# EAGLE board ACB-R1.0-43-CH13 (EAGLE 6.6.0), part 1 of 2
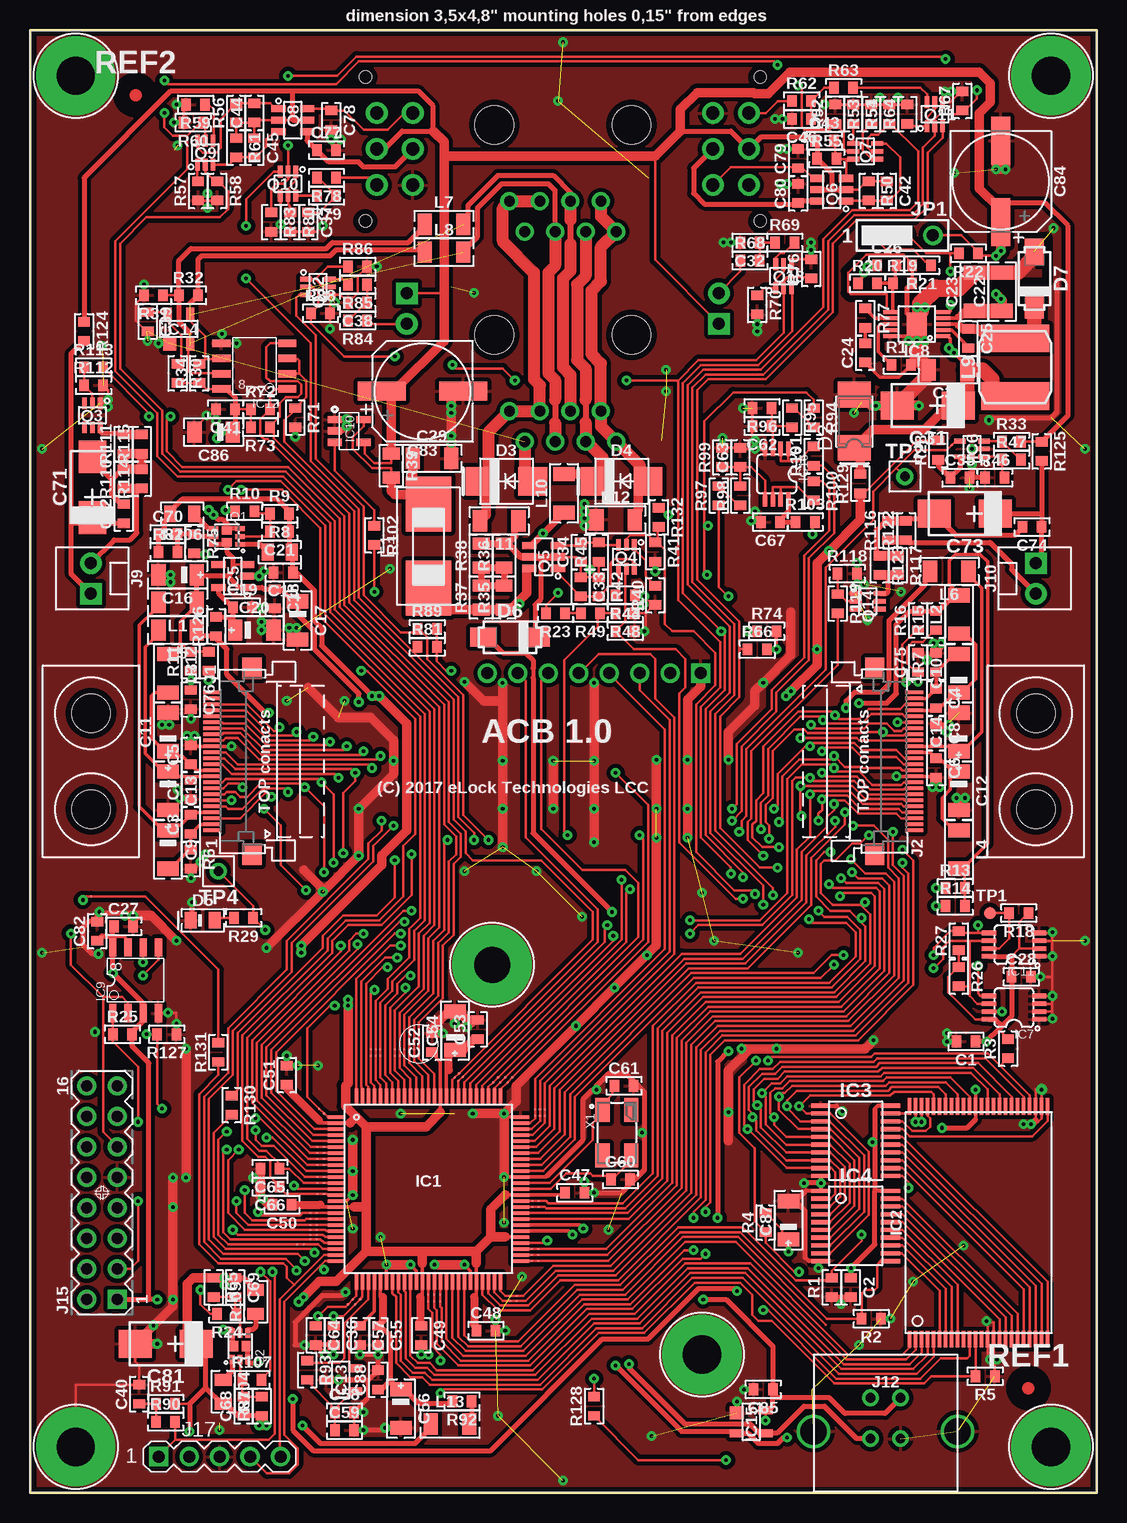
[diagram p5: board, top side]
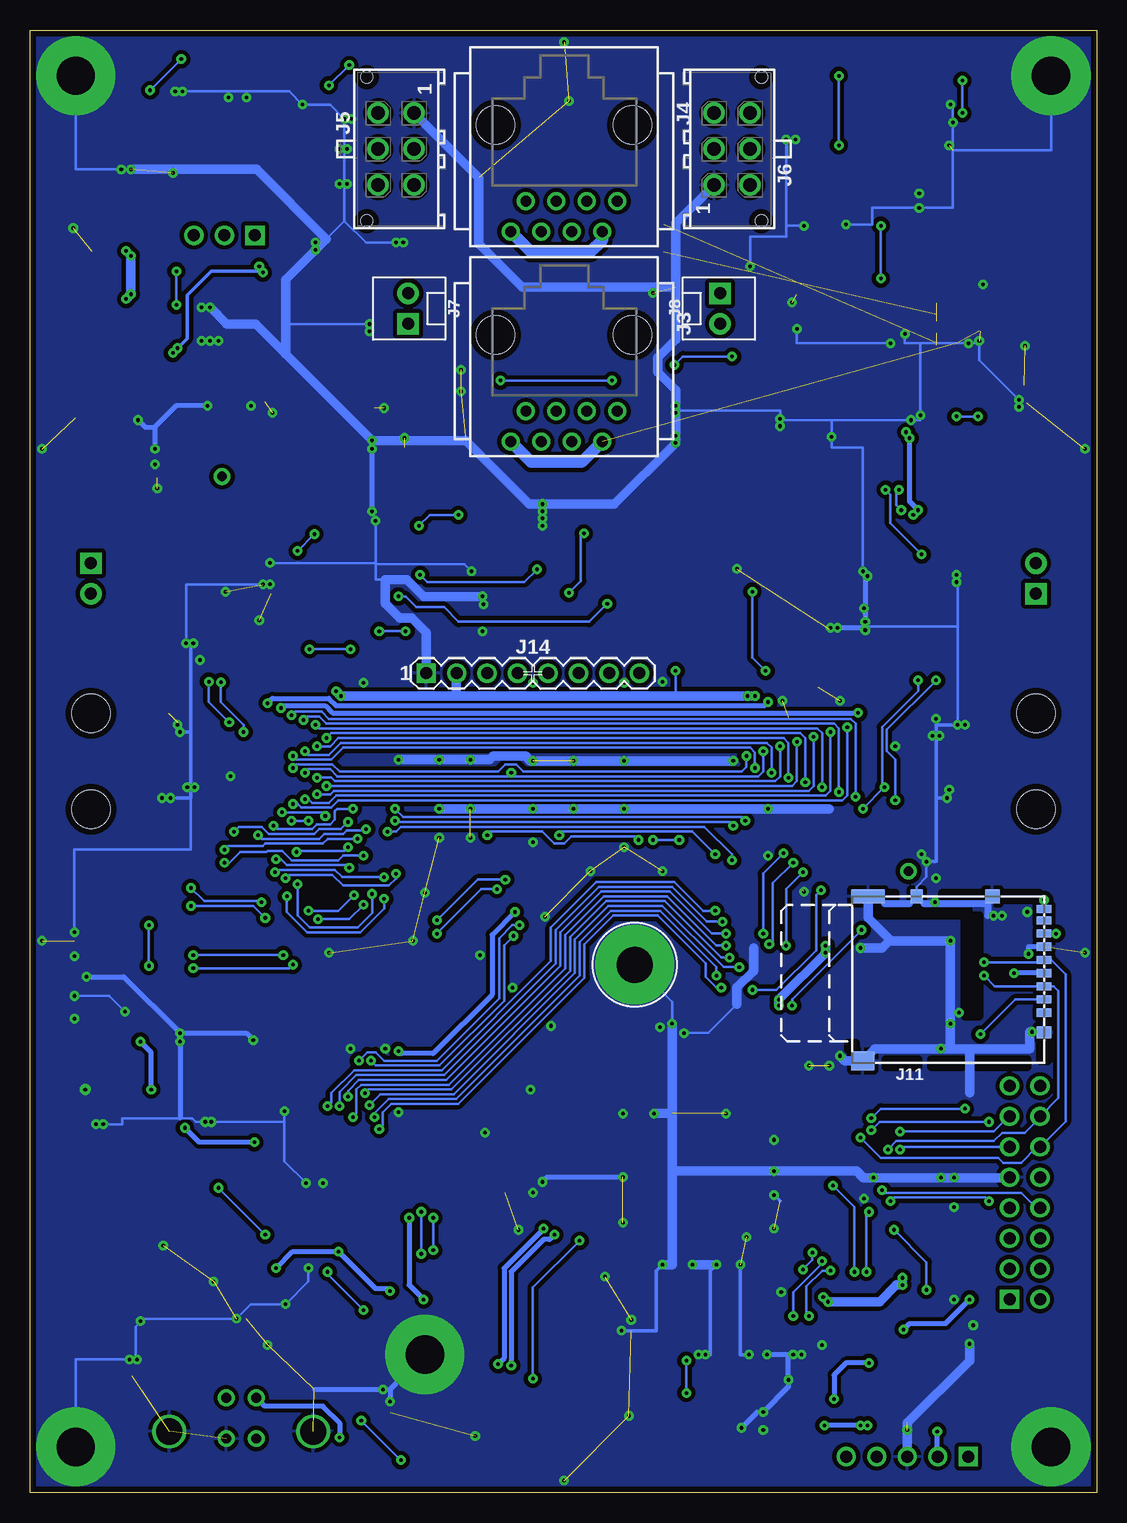
[diagram p6: board, bottom side, seen from below]

Size 88.9 x 121.92 mm. Coordinates in mm from the lower left corner, seen from the top.
Copper layers (1*16): Top 0.035mm / dielectric 1.5mm / Bottom 0.035mm
Design rules "default *": minimum track width 0.2mm, minimum drill 0.3mm, track to track 0.2mm, track to pad 0.2mm, pad to pad 0.2mm, via to via 0.2mm, smd to smd 0.001mm, copper to edge 0.5mm, drill to drill 0.2mm, minimum pad ring 0.3mm, minimum via ring 0.25mm, stop-mask expansion 0.1mm, vias tented up to drill 0.6mm, thermal gap 0.35mm
Net classes: 1 HV: clearance 0.3 mm to class 0
tRestrict: 34 lines

## Footprints (pad centres in the part's own frame; a part is rotated, then mirrored left to right if it is on the bottom)
0603 = smd 0.79 x 0.99: 1 -0.8,0; 2 0.8,0
1206-POL-C = smd 1.19 x 1.79: + -1.6,0; - 1.6,0
1206 = smd 1.19 x 1.79: 1 -1.6,0; 2 1.6,0
CT-C = smd 2.743 x 2.311: + -2.54,0; - 2.54,0
CAP_8MM_DIA_SMT = smd 1.59 x 3.99: 1 0,3.4; 2 0,-3.4
SMA = smd 2.159 x 2.743: + -2.311,0.003; - 2.108,-0.002
SMB = smd 2.4 x 2.4: A 2.2,0; C -2.2,0
0805-POL-D = smd 0.99 x 1.39: A 1,0; K -1,0
SMA' = smd 2.21 x 1.575: A -2.223,0; K 2.223,0
LITTLEFUSE0154 = smd 4.6 x 3.8: 1 3.5,0; 2 -3.5,0
CAM-HOLDER = hole 3.2: 0,4; 0,-4
TQFP100_14X14_0,5MM = smd 1.39 x 0.28: 1 -7.7,6; 2 -7.7,5.5; 3 -7.7,5; 4 -7.7,4.5; 5 -7.7,4; 6 -7.7,3.5; 7 -7.7,3; 8 -7.7,2.5; 9 -7.7,2; 10 -7.7,1.5; 11 -7.7,1; 12 -7.7,0.5; 13 -7.7,0; 14 -7.7,-0.5; 15 -7.7,-1; 16 -7.7,-1.5; 17 -7.7,-2; 18 -7.7,-2.5; 19 -7.7,-3; 20 -7.7,-3.5; 21 -7.7,-4; 22 -7.7,-4.5; 23 -7.7,-5; 24 -7.7,-5.5; 25 -7.7,-6; 51 7.7,-6; 52 7.7,-5.5; 53 7.7,-5; 54 7.7,-4.5; 55 7.7,-4; 56 7.7,-3.5; 57 7.7,-3; 58 7.7,-2.5; 59 7.7,-2; 60 7.7,-1.5; 61 7.7,-1; 62 7.7,-0.5; 63 7.7,0; 64 7.7,0.5; 65 7.7,1; 66 7.7,1.5; 67 7.7,2; 68 7.7,2.5; 69 7.7,3; 70 7.7,3.5; 71 7.7,4; 72 7.7,4.5; 73 7.7,5; 74 7.7,5.5; 75 7.7,6 | smd 0.28 x 1.39: 26 -6,-7.7; 27 -5.5,-7.7; 28 -5,-7.7; 29 -4.5,-7.7; 30 -4,-7.7; 31 -3.5,-7.7; 32 -3,-7.7; 33 -2.5,-7.7; 34 -2,-7.7; 35 -1.5,-7.7; 36 -1,-7.7; 37 -0.5,-7.7; 38 0,-7.7; 39 0.5,-7.7; 40 1,-7.7; 41 1.5,-7.7; 42 2,-7.7; 43 2.5,-7.7; 44 3,-7.7; 45 3.5,-7.7; 46 4,-7.7; 47 4.5,-7.7; 48 5,-7.7; 49 5.5,-7.7; 50 6,-7.7; 76 6,7.7; 77 5.5,7.7; 78 5,7.7; 79 4.5,7.7; 80 4,7.7; 81 3.5,7.7; 82 3,7.7; 83 2.5,7.7; 84 2,7.7; 85 1.5,7.7; 86 1,7.7; 87 0.5,7.7; 88 0,7.7; 89 -0.5,7.7; 90 -1,7.7; 91 -1.5,7.7; 92 -2,7.7; 93 -2.5,7.7; 94 -3,7.7; 95 -3.5,7.7; 96 -4,7.7; 97 -4.5,7.7; 98 -5,7.7; 99 -5.5,7.7; 100 -6,7.7
48-TSOP-I = smd 1.4 x 0.28: 1 -9.7,5.75; 2 -9.7,5.25; 3 -9.7,4.75; 4 -9.7,4.25; 5 -9.7,3.75; 6 -9.7,3.25; 7 -9.7,2.75; 8 -9.7,2.25; 9 -9.7,1.75; 10 -9.7,1.25; 11 -9.7,0.75; 12 -9.7,0.25; 13 -9.7,-0.25; 14 -9.7,-0.75; 15 -9.7,-1.25; 16 -9.7,-1.75; 17 -9.7,-2.25; 18 -9.7,-2.75; 19 -9.7,-3.25; 20 -9.7,-3.75; 21 -9.7,-4.25; 22 -9.7,-4.75; 23 -9.7,-5.25; 24 -9.7,-5.75; 25 9.7,-5.75; 26 9.7,-5.25; 27 9.7,-4.75; 28 9.7,-4.25; 29 9.7,-3.75; 30 9.7,-3.25; 31 9.7,-2.75; 32 9.7,-2.25; 33 9.7,-1.75; 34 9.7,-1.25; 35 9.7,-0.75; 36 9.7,-0.25; 37 9.7,0.25; 38 9.7,0.75; 39 9.7,1.25; 40 9.7,1.75; 41 9.7,2.25; 42 9.7,2.75; 43 9.7,3.25; 44 9.7,3.75; 45 9.7,4.25; 46 9.7,4.75; 47 9.7,5.25; 48 9.7,5.75
TSSOP20 = smd 1.6 x 0.35: 1 -2.9,2.925; 2 -2.9,2.275; 3 -2.9,1.625; 4 -2.9,0.975; 5 -2.9,0.325; 6 -2.9,-0.325; 7 -2.9,-0.975; 8 -2.9,-1.625; 9 -2.9,-2.275; 10 -2.9,-2.925; 11 2.9,-2.925; 12 2.9,-2.275; 13 2.9,-1.625; 14 2.9,-0.975; 15 2.9,-0.325; 16 2.9,0.325; 17 2.9,0.975; 18 2.9,1.625; 19 2.9,2.275; 20 2.9,2.925
SOT23-5 = smd 0.59 x 1.19: 1 -0.95,-1.2; 2 0,-1.2; 3 0.95,-1.2; 4 0.95,1.2; 5 -0.95,1.2
SC-70-5 = smd 0.39 x 0.99: 1 -0.65,-1; 2 0,-1; 3 0.65,-1; 4 0.65,1; 5 -0.65,1
MSOP-08 = smd 0.38 x 1.2: 1 -1,-2.1; 2 -0.35,-2.1; 3 0.3,-2.1; 4 0.95,-2.1; 5 0.95,2.1; 6 0.3,2.1; 7 -0.35,2.1; 8 -1,2.1
MSOP10EXP = smd 0.3 x 1.2: 1 -1,-2.2; 2 -0.5,-2.2; 3 0,-2.2; 4 0.5,-2.2; 5 1,-2.2; 6 1,2.2; 7 0.5,2.2; 8 0,2.2; 9 -0.5,2.2; 10 -1,2.2 | smd 1.88 x 1.68: EP 0,0
SO-08 = smd 0.61 x 1.524: 1 -1.905,-2.743; 2 -0.635,-2.743; 3 0.635,-2.743; 4 1.905,-2.743; 5 1.905,2.743; 6 0.635,2.743; 7 -0.635,2.743; 8 -1.905,2.743
SOT23-5' = smd 0.6 x 1.2: 1 -0.95,-1.206; 2 0,-1.206; 3 0.95,-1.206; 4 0.95,1.206; 5 -0.95,1.206
SO08 = smd 0.61 x 1.524: 1 -1.905,-2.743; 2 -0.635,-2.743; 3 0.635,-2.743; 4 1.905,-2.743; 5 1.905,2.743; 6 0.635,2.743; 7 -0.635,2.743; 8 -1.905,2.743
SOT23 = smd 0.69 x 1.19: 1 0.95,1.2; 2 -0.95,1.2; 3 0,-1.2
SOT-143 = smd 1.09 x 1.19: 1 -0.75,-1.2 | smd 0.69 x 1.19: 2 0.95,-1.2; 3 0.95,1.2; 4 -0.95,1.2
FH12A-24S-05SH = smd 0.3 x 1.5: 1 -5.75,2.8; 2 -5.25,2.8; 3 -4.75,2.8; 4 -4.25,2.8; 5 -3.75,2.8; 6 -3.25,2.8; 7 -2.75,2.8; 8 -2.25,2.8; 9 -1.75,2.8; 10 -1.25,2.8; 11 -0.75,2.8; 12 -0.25,2.8; 13 0.25,2.8; 14 0.75,2.8; 15 1.25,2.8; 16 1.75,2.8; 17 2.25,2.8; 18 2.75,2.8; 19 3.25,2.8; 20 3.75,2.8; 21 4.25,2.8; 22 4.75,2.8; 23 5.25,2.8; 24 5.75,2.8 | smd 1.8 x 1.6: C1 -7.75,-0.5; C2 7.75,-0.5
RJ8-8-180 = drill 0.9 pad 1.4: 1 -4.445,6.35; 2 -3.175,8.89; 3 -1.905,6.35; 4 -0.635,8.89; 5 0.635,6.35; 6 1.905,8.89; 7 3.175,6.35; 8 4.445,8.89 | hole 3.2: 5.715,0; -5.715,0
MOLEX430450613 = drill 1.1 pad 1.8: 1 3,-1.5; 2 0,-1.5; 3 -3,-1.5; 4 3,1.5; 5 0,1.5; 6 -3,1.5 | hole 1: 6,2.45; -6,2.45
3-641215-2 = drill 1 pad 1.8 square: 1 1.27,0 | drill 1 pad 1.8: 2 -1.27,0
DM3AT = smd 0.69 x 1.19: 1 3.3,8; 2 2.2,8; 3 1.1,8; 4 0,8; 5 -1.1,8; 6 -2.2,8; 7 -3.3,8; 8 -4.4,8; G2 -5.35,8 | smd 0.99 x 1.19: G1 4.95,8 | smd 1.19 x 1.19: G3 -6.4,3.7 | smd 1.19 x 0.99: G4 -6.4,-2.6 | smd 1.19 x 2.79: G5 -6.4,-6.65 | smd 1.59 x 1.89: G6 7.3,-7.1
USB_B_180 = drill 0.8 pad 1.4: 1_+5V 1.25,2.8; 2_D- -1.25,2.8; 3_D+ -1.25,-0.6; 4_GND 1.25,-0.6 | drill 2.2 pad 2.8: SH1 -6,0; SH2 6,0
MA08-1-MALE = drill 1 pad 1.6 square: 1 -8.89,0 | drill 1 pad 1.6: 2 -6.35,0; 3 -3.81,0; 4 -1.27,0; 5 1.27,0; 6 3.81,0; 7 6.35,0; 8 8.89,0
MA08-2 = drill 1 pad 1.6 square: 1 -8.89,-1.27 | drill 1 pad 1.6: 2 -8.89,1.27; 3 -6.35,-1.27; 4 -6.35,1.27; 5 -3.81,-1.27; 6 -3.81,1.27; 7 -1.27,-1.27; 8 -1.27,1.27; 9 1.27,-1.27; 10 1.27,1.27; 11 3.81,-1.27; 12 3.81,1.27; 13 6.35,-1.27; 14 6.35,1.27; 15 8.89,-1.27; 16 8.89,1.27
MA05-1 = drill 1 pad 1.6 square: 1 -5.08,0 | drill 1 pad 1.6: 2 -2.54,0; 3 0,0; 4 2.54,0; 5 5.08,0
JP3CLOSE12 = drill 1 pad 1.626 square: 1 -2.54,0 | drill 1 pad 1.626: 2 0,0; 3 2.54,0
NR6028 = smd 2.3 x 5.7: 1 2.4,0; 2 -2.4,0
TEMP-PAD = smd 0.2 x 0.2: P$1 0,0
PCB-ACB = drill 3.2 pad 6.6: PAD_GND_1 3.81,118.11; PAD_GND_2 85.09,118.11; PAD_GND_3 3.81,3.81; PAD_GND_4 85.09,3.81
PCB-VPS = drill 3.2 pad 6.6: VPS_PCB_1 55,4
BT_MODULE_BRD = drill 3 pad 6.6: 1 25.5,20.5
MICRO_FET = smd 0.4 x 0.8: 1 -0.65,-1.1; 2 0,-1.1; 3 0.65,-1.1; 4 0.65,1.1; 5 0,1.1; 6 -0.65,1.1 | smd 0.7 x 0.86: P1 -0.5,0; P2 0.5,0
SC70-6 = smd 0.39 x 0.99: 1 -0.65,-1; 2 0,-1; 3 0.65,-1; 4 0.65,1; 5 0,1; 6 -0.65,1
SSOT-6 = smd 0.6 x 1.2: 1 -0.95,-1.2; 2 0,-1.2; 3 0.95,-1.206; 4 0.95,1.2; 5 0,1.2; 6 -0.95,1.2
0805 = smd 0.99 x 1.39: 1 -1,0; 2 1,0
SMD_ROUND_1MM = smd 1 x 1: P$1 0,0
TH_ROUND_14MM08MM = drill 0.8 pad 1.4: P$1 0,0
7B = smd 2 x 1.2: 1 -1.9,-1.2; 2 1.9,-1.2; 3 1.9,1.2; 4 -1.9,1.2

## Placement (x,y rotation side)
C1  100n  [0603]  78,37.6 180 top
C2  100n  [0603]  68.4,17.1 270 top
C3  100n  [0603]  13.4,55.7 90 top
C4  100n  [0603]  75.5,66.2 270 top
C5  100n  [0603]  13.4,61.5 90 top
C6  100n  [0603]  75.5,60.4 270 top
C7  100n  [0603]  13.4,58.6 90 top
C8  100n  [0603]  75.5,63.3 270 top
C9  10uTA  [1206-POL-C]  11.5,53.6 270 top
C10  10uTA  [1206-POL-C]  77.4,68.3 90 top
C11  10uTA  [1206-POL-C]  11.5,63.4 90 top
C12  10uTA  [1206-POL-C]  77.4,58.5 270 top
C13  10uTA  [1206-POL-C]  11.5,58.5 270 top
C14  10uTA  [1206-POL-C]  77.4,63.4 90 top
C15  10u  [0603]  21.1,76.7 180 top
C16  10uTA  [1206-POL-C]  12.3,76.5 180 top
C17  10uTA  [1206-POL-C]  22.3,72.7 270 top
C18  100n  [0603]  20.4,74.5 270 top
C19  100n  [0603]  17.7,73.8 0 top
C20  10uTA  [1206-POL-C]  18.7,71.9 0 top
C21  1n->10n  [0603]  20.8,80.1 180 top
C22  4u7/50  [1206]  81,100.1 90 top
C23  4u7/50  [1206]  78.7,100.1 90 top
C24  1n  [0603]  69.6,95 90 top
C25  470n/25  [0603]  78.2,96.2 270 top
C26  10p  [0603]  71.4,102.3 0 top
C27  100n  [0603]  7.8,47.2 0 top
C28  100n  [0603]  82.6,43 0 top
C29  4u7/50  [1206]  33.5,86.2 0 top
C30  47u/6.3  [1206]  76.5,93.6 180 top
C31  47uTC  [CT-C]  74.8,90.6 180 top
C32  100n  [0603]  60,104.2 180 top
C33  100n  [0603]  45.9,75.5 270 top
C34  1n  [0603]  45.9,78.4 90 top
C35  100n  [0603]  77.5,84.6 0 top
C36  100n  [0603]  25.3,13.1 270 top
C37  100n  [0603]  23.2,105.9 270 top
C38  100n  [0603]  27.3,99.2 180 top
C39  100n  [0603]  9.8,97.6 270 top
C40  100n  [0603]  9.1,8.2 90 top
C41  100n  [0603]  16.3,90.3 180 top
C42  100n  [0603]  71.4,108.5 270 top
C43  1n  [0603]  66.2,112.7 0 top
C44  1n  [0603]  18.7,115 90 top
C45  100n  [0603]  18.7,112.1 270 top
C46  100n  [0603]  64.3,114.5 180 top
C47  100n  [0603]  45.4,25 0 top
C48  1u  [0603]  38,13.5 0 top
C49  100n  [0603]  32.6,13.1 270 top
C50  1u  [0603]  21,24 180 top
C51  100n  [0603]  21.4,34.8 90 top
C52  1u  [0603]  33.5,37.5 90 top
C53  10u  [0603]  37.3,38.6 90 top
C54  10uTA  [1206-POL-C]  35.4,38.5 90 top
C55  100n  [0603]  29,13.1 270 top
C56  10uTA  [1206-POL-C]  30.9,7 270 top
C57  100n->10n  [0603]  27.5,13.1 270 top
C58  100n  [0603]  26.2,6.7 0 top
C59  1u->100n  [0603]  26.2,5.2 0 top
C60  18p  [0603]  49.2,26.1 0 top
C61  18p  [0603]  49.5,33.9 0 top
C62  1n  [0603]  61,88.9 180 top
C63  1n  [0603]  59.2,86.3 90 top
C64  100n  [0603]  23.8,13.1 270 top
C65  1n  [0603]  20,27 180 top
C66  10n  [0603]  20,25.5 180 top
C67  10u  [0603]  61.7,80.9 180 top
C68  1n->10n  [0603]  17.8,7.2 90 top
C69  1n  [0603]  17.1,17.1 270 top
C70  1n  [0603]  11.5,79.9 0 top
C71  47uTC  [CT-C]  5.2,83.8 90 top
C72  100n  [0603]  7.8,81.6 90 top
C73  47uTC  [CT-C]  77.9,81.6 180 top
C74  100n  [0603]  83.5,80.5 180 top
C75  100n  [0603]  74,69.2 90 top
C76  100n  [0603]  13.4,66.1 270 top
C77  100n  [0603]  24.7,111.9 0 top
C78  100n  [0603]  25.1,114.4 270 top
C79  100n  [0603]  64,111.2 90 top
C80  100n  [0603]  64,108.3 90 top
C81  47uTC  [CT-C]  11.3,12.4 180 top
C82  1u  [0603]  5.6,46.8 90 top
C83  220u/25V  [CAP_8MM_DIA_SMT]  32.7,91.8 90 top
C84  220u/25V  [CAP_8MM_DIA_SMT]  80.9,109.3 180 top
C85  100n  [0603]  61.1,8.6 180 top
C86  10uTA  [1206-POL-C]  15.3,88.4 180 top
C87  10uTA  [1206-POL-C]  63.2,22.7 90 top
C88  10u  [0603]  29,9.4 90 top
D2  SMLVT3V3  [SMA]  68.7,89.4 90 top
D3  P6SMB20A  [SMB]  39.7,84.3 0 top
D4  P6SMB20A  [SMB]  49.3,84.3 0 top
D5  LED-GREEN  [0805-POL-D]  14.4,47.7 0 top
D6  SS14  [SMA']  40,71.3 0 top
D7  SS14  [SMA']  83.7,101.2 270 top
F1  T1A-LITTLEFUSE0154  [LITTLEFUSE0154]  33.2,78.9 90 top
H1  CAM-HOLDER  [CAM-HOLDER]  83.82,60.96 0 top
H2  CAM-HOLDER  [CAM-HOLDER]  5.08,60.96 0 top
IC1  PIC32MX470F512L-I/PF  [TQFP100_14X14_0,5MM]  33.2,25.3 0 top
IC2  R1LV1616  [48-TSOP-I]  79.05,22.5 90 top
IC3  74LVC573APW-TSSOP20  [TSSOP20]  68.8,29.32 0 top
IC4  74LVC573APW-TSSOP20  [TSSOP20]  68.8,22.23 0 top
IC5  TLV73315PDBV  [SOT23-5]  16.9,76.4 90 top
IC6  MIC841LYC  [SC-70-5]  78.5,87 90 top
IC7  24LC32A-I/MS  [MSOP-08]  82,40.45 90 top
IC8  LT3971EMSE  [MSOP10EXP]  73.9,97.4 90 top
IC9  AT25SF321-SSHD  [SO-08]  8.8,42.7 0 top
IC10  MAX9938HEUK+T  [SOT23-5']  26.6,88.5 270 top
IC11  24LC32A-I/MS  [MSOP-08]  82,45.7 90 top
IC12  SN65HVD12D  [SO08]  18.7,93.9 90 top
IC13  REF3025  [SOT23]  25.9,9.4 270 top
IC14  TPD2E001DZDR  [SOT-143]  12.4,97 0 top
IC15  TPD2E001DZDR  [SOT-143]  60.1,5.9 270 top
IC16  MCP6042-I/MS  [MSOP-08]  62.2,84.9 180 top
J1  FH12A-24S-0.5SH  [FH12A-24S-05SH]  18,60.95 90 top
J2  FH12A-24S-0.5SH  [FH12A-24S-05SH]  70.9,60.95 270 top
J3  RJ8-8-180  [RJ8-8-180]  44.4,96.5 180 bottom
J4  RJ8-8-180  [RJ8-8-180]  44.4,114 180 bottom
J5  MOLEX430450613  [MOLEX430450613]  58.4,112 90 bottom
J6  MOLEX430450613  [MOLEX430450613]  30.4,112 270 bottom
J7  3-641215-2  [3-641215-2]  57.4,98.7 270 bottom
J8  3-641215-2  [3-641215-2]  31.4,98.7 90 bottom
J9  3-641215-2  [3-641215-2]  5.08,76.2 270 top
J10  3-641215-2  [3-641215-2]  83.82,76.2 90 top
J11  DNP-DM3AT  [DM3AT]  12.4,43.3 270 bottom
J12  USB_A_180  [USB_B_180]  71.3,5.1 0 top
J14  pin1x8  [MA08-1-MALE]  47,68.3 0 bottom
J15  pin2x8  [MA08-2]  6,25 90 top
J17  DNP-open-hole  [MA05-1]  15.8,3 0 top
JP1  JP3CLOSE12  [JP3CLOSE12]  72.7,104.8 0 top
L1  LQM31PN3R3M00L  [1206]  12.3,74.2 180 top
L2  LQM31PN3R3M00L  [1206]  77.4,73.2 90 top
L3  LQM31PN3R3M00L  [1206]  11.5,68.3 270 top
L4  LQM31PN3R3M00L  [1206]  77.4,53.6 270 top
L5  LQM31PN3R3M00L  [1206]  12.3,71.9 180 top
L6  LQM31PN3R3M00L  [1206]  76.6,76.8 180 top
L7  HI1206T500R  [1206]  34.5,105.7 0 top
L8  HI1206T500R  [1206]  34.5,103.4 0 top
L9  NR6028T4R7M  [NR6028]  82.1,93.8 90 top
L10  HI1206T500R  [1206]  44.5,83.3 90 top
L11  HI1206T500R  [1206]  39.1,81 180 top
L12  HI1206T500R  [1206]  48.8,81.1 0 top
L13  LQM31PN3R3M00L  [1206]  35,5.7 0 top
O1  PIC-OUT  [TEMP-PAD]  24.5,31.6 0 top
O2  PIC-RPX  [TEMP-PAD]  24.5,28.8 90 top
O3  PIC-RPX  [TEMP-PAD]  24.5,28.3 90 top
O4  PIC-RPX  [TEMP-PAD]  24.5,27.8 90 top
O5  PIC-RPX  [TEMP-PAD]  24.5,27.3 0 top
O6  PIC-RPX  [TEMP-PAD]  24.5,26.3 0 top
O7  PIC-RPX  [TEMP-PAD]  24.5,25.8 0 top
O8  PIC-RPX  [TEMP-PAD]  24.5,24.9 0 top
O9  PIC-OUT  [TEMP-PAD]  23.9,23.3 0 top
O10  PIC-RPX  [TEMP-PAD]  23.9,22.8 0 top
O11  PIC-RPX  [TEMP-PAD]  23.9,22.3 0 top
O12  PIC-RPX  [TEMP-PAD]  23.9,21.9 0 top
O13  PIC-RPX  [TEMP-PAD]  23.9,21.1 0 top
O14  PIC-RPX  [TEMP-PAD]  22.8,20.7 270 top
O15  PIC-RPX  [TEMP-PAD]  26.9,16.1 90 top
O16  PIC-RPX  [TEMP-PAD]  27.5,16.1 0 top
O17  PIC-OUT  [TEMP-PAD]  33.2,16.5 0 top
O18  PIC-RPX  [TEMP-PAD]  33.7,16.5 0 top
O19  PIC-RPX  [TEMP-PAD]  34.2,16.5 0 top
O20  PIC-RPX  [TEMP-PAD]  40,16 0 top
O21  PIC-RPX  [TEMP-PAD]  40,16.4 0 top
O22  PIC-OUT  [TEMP-PAD]  28.4,36.4 0 top
O23  PIC-OUT  [TEMP-PAD]  28.8,36.4 0 top
O24  PIC-OUT  [TEMP-PAD]  29.2,36.4 0 top
O25  PIC-OUT  [TEMP-PAD]  30.4,36.4 0 top
O26  PIC-OUT  [TEMP-PAD]  30.8,36.4 0 top
O27  PIC-RPX  [TEMP-PAD]  31.2,36.4 0 top
O28  PIC-RPX  [TEMP-PAD]  31.6,36.4 0 top
O29  PIC-RPX  [TEMP-PAD]  32,36.4 0 top
O30  PIC-RPX  [TEMP-PAD]  32.4,36.4 0 top
O31  PIC-OUT  [TEMP-PAD]  35.4,34.6 0 top
O32  PIC-OUT  [TEMP-PAD]  35.7,34.3 0 top
O33  PIC-RPX  [TEMP-PAD]  38.6,34.2 0 top
O34  PIC-RPX  [TEMP-PAD]  39.2,34.2 0 top
O35  PIC-RPX  [TEMP-PAD]  40.2,34.6 0 top
O36  PIC-RPX  [TEMP-PAD]  42.1,31.4 90 top
O37  PIC-RPX  [TEMP-PAD]  42.5,31.4 90 top
O38  PIC-RPX  [TEMP-PAD]  42.9,31.4 90 top
O39  PIC-OUT  [TEMP-PAD]  41.85,24.3 0 top
O40  PIC-OUT  [TEMP-PAD]  41.85,23.8 0 top
O41  PIC-RPX  [TEMP-PAD]  42.35,20.3 180 top
O42  PIC-RPX  [TEMP-PAD]  41.8,19.8 180 top
O43  PIC-RPX  [TEMP-PAD]  41.8,19.3 0 top
O44  PIC-OUT  [TEMP-PAD]  23.9,21.5 0 top
PCB1  PCB-ACB  [PCB-ACB]  0,0 0 top
PCB2  DNP-PCB-VPS  [PCB-VPS]  1,7.5 0 top
PCB3  DNP-PCB-BT  [BT_MODULE_BRD]  59,69.5 270 bottom
Q1  SSM6P49NU,LFPZ  [MICRO_FET]  16.4,79.7 90 top
Q2  SSM6P49NU,LFPZ  [MICRO_FET]  17.5,12.2 0 top
Q3  FDG6303N  [SC70-6]  5.2,89.8 180 top
Q4  FDG6303N  [SC70-6]  49.7,78 180 top
Q5  FDC6506P  [SSOT-6]  42.8,78 90 top
Q6  FDC6506P  [SSOT-6]  66.8,108.6 90 top
Q7  FDG6303N  [SC70-6]  69.6,111.8 270 top
Q8  FDC6506P  [SSOT-6]  21.9,114.4 270 top
Q9  FDG6303N  [SC70-6]  14.6,111.7 0 top
Q10  FDG6303N  [SC70-6]  21.5,109.1 180 top
Q11  FDG6303N  [SC70-6]  75.4,114.9 0 top
Q12  FDG6303N  [SC70-6]  24,100.5 270 top
Q13  FDG6303N  [SC70-6]  62.8,101.4 0 top
Q14  FDG6303N  [SC70-6]  69.8,74.3 270 top
R1  1M  [0603]  66.8,17.1 90 top
R2  1M  [0603]  70.1,14.5 180 top
R3  1M  [0603]  81.5,37 90 top
R4  1M  [0603]  61.3,22.5 90 top
R5  1M  [0603]  79.6,9.7 180 top
R6  0R  [0603]  13.4,52.8 270 top
R7  0R  [0603]  75.5,69.2 90 top
R8  1R  [0805]  20.8,78.4 0 top
R9  1M  [0603]  20.8,81.6 0 top
R10  100k  [0603]  17.9,81.8 0 top
R11  10k  [0603]  13.4,69.3 90 top
R12  100k  [0603]  14.9,69.3 90 top
R13  10k  [0603]  77.1,50.4 0 top
R14  10k  [0603]  77.1,48.9 0 top
R15  10k  [0603]  75.5,72.7 90 top
R16  100k  [0603]  74,72.7 90 top
R17  47k  [0603]  72.6,94 0 top
R18  10k  [0603]  82.4,48.3 180 top
R19  560k  [0603]  72.7,100.8 0 top
R20  1M  [0603]  69.8,100.8 0 top
R21  1M  [0603]  74.3,102.3 180 top
R22  4M99  [0603]  78.2,103.3 180 top
R23  1M  [0603]  43.8,73.3 180 top
R24  100k  [0603]  16.4,14.9 180 top
R25  1M  [0603]  7.7,38.2 0 top
R26  10k  [0603]  77.4,43 270 top
R27  10k  [0603]  77.4,46 90 top
R28  100R  [0603]  75.7,86.9 90 top
R29  300R  [0603]  17.8,47.9 180 top
R30  10k  [0603]  12.3,93.3 270 top
R31  1M  [0603]  10.3,99.8 180 top
R32  1M  [0603]  13.2,99.8 0 top
R33  4M99  [0603]  81.8,87.6 0 top
R34  1M  [0603]  14.1,93.3 90 top
R35  1k  [0805]  39.5,74.6 90 top
R36  1k  [0805]  39.5,78.1 90 top
R37  1k  [0805]  37.6,74.6 90 top
R38  1k  [0805]  37.6,78.1 90 top
R39  0.025R  [0805]  30.1,85.6 270 top
R40  300k  [0603]  52.1,74.8 90 top
R41  1M  [0603]  52.1,78.4 270 top
R42  1M  [0603]  47.4,75.5 270 top
R43  300k  [0603]  49.6,74.8 180 top
R44  1M  [0603]  49.6,71.8 0 top
R45  1M  [0603]  47.4,78.4 90 top
R46  560k->750k  [0603]  80.4,84.6 0 top
R47  100k->180k  [0603]  81.8,86.1 0 top
R48  1M  [0603]  49.6,73.3 180 top
R49  560k  [0603]  46.7,73.3 180 top
R50  1M  [0603]  69.9,108.5 270 top
R51  300k  [0603]  68.6,114.9 270 top
R52  1M  [0603]  67.1,114.9 90 top
R53  300k  [0603]  70.1,114.9 90 top
R54  1M  [0603]  71.6,114.9 90 top
R55  1M  [0603]  66.4,111.2 0 top
R56  1M  [0603]  17.2,115 90 top
R57  300k  [0603]  14,108.5 90 top
R58  1M  [0603]  15.6,108.5 270 top
R59  300k  [0603]  13.8,115.7 180 top
R60  1M  [0603]  13.6,114.2 180 top
R61  1M  [0603]  17.2,112.1 270 top
R62  100R  [0603]  64.3,116 0 top
R63  1k->4k7  [0603]  67.8,117.1 0 top
R64  1k  [0603]  73.1,114.9 90 top
R65  1M  [0603]  15.3,17.1 270 top
R66  100k  [0603]  60.6,70.3 0 top
R67  1M  [0603]  77.7,116 90 top
R68  100R  [0603]  60,102.7 0 top
R69  1k->4k7  [0603]  62.9,104.2 0 top
R70  1k  [0603]  60.6,99 270 top
R71  10k  [0603]  22.1,89.6 270 top
R72  1M  [0603]  19.2,90.3 0 top
R73  1M  [0603]  19.2,88.8 180 top
R74  100k  [0603]  61.4,71.8 0 top
R75  100k  [0603]  13.7,79.1 270 top
R76  1M  [0603]  65.1,102 90 top
R77  47k  [0603]  69.6,97.9 270 top
R78  100R  [0603]  24.7,109.6 180 top
R79  1k->4k7  [0603]  24.7,108.1 180 top
R80  1k  [0603]  21.7,105.9 270 top
R81  100k  [0603]  33.1,70.5 0 top
R82  1M  [0603]  11.5,78.4 0 top
R83  1M  [0603]  20.1,105.9 270 top
R84  100R  [0603]  27.3,97.7 180 top
R85  1k->4k7  [0603]  27.3,100.7 180 top
R86  1k  [0603]  27.3,102.2 0 top
R87  1M  [0603]  19.3,7.2 90 top
R88  1M  [0603]  24.2,98.3 0 top
R89  100k  [0603]  33.1,72 0 top
R90  1k  [0603]  11.3,5.9 0 top
R91  10k  [0603]  11.3,7.4 0 top
R92  10R  [0603]  36,7.6 180 top
R93  300R  [0603]  23.1,10.2 270 top
R94  180k  [0603]  65.3,89.6 270 top
R95  4M99  [0603]  63.5,89.6 270 top
R96  560k  [0603]  61,90.4 180 top
R97  180k  [0603]  57.4,83.1 90 top
R98  4M99  [0603]  59.2,83.1 90 top
R99  560k  [0603]  57.7,86.3 90 top
R100  2k2  [0603]  65.3,83.5 270 top
R101  2k2  [0603]  65.3,86.4 90 top
R102  1k  [0603]  28.7,79.8 270 top
R103  300R  [0603]  64.6,80.9 0 top
R104  1R  [0805]  16.1,8.4 270 top
R105  1R  [0805]  18.8,15.9 90 top
R106  1R  [0805]  12.7,81.6 180 top
R107  100k  [0603]  18.5,9.4 0 top
R110  100R  [0603]  7.8,84.5 90 top
R111  100R  [0603]  7.8,87.4 90 top
R112  1M  [0603]  5.3,92.3 0 top
R113  100R  [0603]  5.3,93.8 0 top
R114  100R  [0603]  9.3,84.5 90 top
R115  100R  [0603]  9.3,87.4 90 top
R116  100R  [0603]  71.5,80.2 90 top
R117  100R  [0603]  72.3,77.3 270 top
R118  1M  [0603]  68.1,76.6 0 top
R119  100R  [0603]  67.3,74.1 270 top
R122  100R  [0603]  73,80.2 90 top
R123  100R  [0603]  70.8,77.3 270 top
R124  0R  [0603]  4.5,96.8 270 top
R125  0R  [0603]  84.3,86.8 270 top
R126  0R  [0603]  15.5,72.2 90 top
R127  1M  [0603]  11.4,38.2 180 top
R128  10k  [0603]  47,7.2 90 top
R129  DNP/0R  [0603]  69.2,84.1 90 top
R130  100k  [0603]  16.8,32.3 270 top
R131  100k  [0603]  15.7,36.7 90 top
R132  1M  [0603]  52.4,81.3 270 top
REF1  REF  [REF]  83.2,8.7 0 top
REF2  REF  [REF]  8.8,116.5 0 top
T1  PIC-OUT  [TEMP-PAD]  42.4,24.3 0 top
T2  PIC-OUT  [TEMP-PAD]  30.8,36.95 0 top
T3  PIC-RPX  [TEMP-PAD]  23.95,25.8 180 top
T4  PIC-OUT  [TEMP-PAD]  30.4,36.95 270 top
T5  PIC-OUT  [TEMP-PAD]  42.35,19.8 180 top
T6  PIC-OUT  [TEMP-PAD]  42.4,23.8 180 top
T7  PIC-OUT  [TEMP-PAD]  41.8,20.3 180 top
T8  PIC-OUT  [TEMP-PAD]  42.35,19.3 180 top
T9  PIC-RPX  [TEMP-PAD]  31.6,36.95 180 top
T10  PIC-RPX  [TEMP-PAD]  40.55,16 0 top
T11  PIC-RPX  [TEMP-PAD]  39.6,34.6 0 top
T12  PIC-RPX  [TEMP-PAD]  40.55,16.4 0 top
T13  PIC-RPX  [TEMP-PAD]  32,36.95 0 top
T14  PIC-RPX  [TEMP-PAD]  32.4,36.95 270 top
T15  PIC-OUT  [TEMP-PAD]  35.75,34.95 270 top
T16  PIC-RPX  [TEMP-PAD]  23.95,28.3 90 top
T17  PIC-RPX  [TEMP-PAD]  39.8,34.2 270 top
T18  PIC-RPX  [TEMP-PAD]  23.95,28.8 270 top
T19  PIC-RPX  [TEMP-PAD]  23.95,27.8 0 top
T20  PIC-OUT  [TEMP-PAD]  28.4,36.95 180 top
T21  PIC-OUT  [TEMP-PAD]  33.7,15.95 270 top
T22  PIC-RPX  [TEMP-PAD]  23.35,21.1 180 top
T23  PIC-RPX  [TEMP-PAD]  23.35,21.9 270 top
T24  PIC-RPX  [TEMP-PAD]  23.35,22.3 270 top
T25  PIC-OUT  [TEMP-PAD]  23.35,22.8 270 top
T26  PIC-OUT  [TEMP-PAD]  22.25,20.7 270 top
T27  PIC-OUT  [TEMP-PAD]  23.95,26.3 270 top
T28  PIC-OUT  [TEMP-PAD]  33.2,15.95 270 top
T29  PIC-OUT  [TEMP-PAD]  23.95,27.3 0 top
T30  PIC-OUT  [TEMP-PAD]  29.2,36.95 180 top
T31  PIC-OUT  [TEMP-PAD]  23.35,23.3 270 top
T32  PIC-OUT  [TEMP-PAD]  23.35,21.5 270 top
T33  PIC-OUT  [TEMP-PAD]  28.8,36.95 270 top
T34  PIC-RPX  [TEMP-PAD]  31.2,36.95 180 top
T35  PIC-RPX  [TEMP-PAD]  34.2,15.95 270 top
T36  PIC-OUT  [TEMP-PAD]  24.1,32 0 top
T37  PIN-AN  [TEMP-PAD]  26.5,15.7 0 top
T38  PIN-AN  [TEMP-PAD]  27.1,15.7 270 top
T39  PIN-AN  [TEMP-PAD]  23.95,24.9 270 top
T40  PIC-RPX  [TEMP-PAD]  42.5,31.95 90 top
T41  PIC-RPX  [TEMP-PAD]  42.1,31.95 90 top
T42  PIC-OUT  [TEMP-PAD]  42.9,31.95 270 top
T43  PIC-RPX  [TEMP-PAD]  39,34.6 0 top
T44  PIC-OUT  [TEMP-PAD]  36.05,34.65 270 top
T45  PIC-RPX  [TEMP-PAD]  76.8,87.3 180 top
T46  PIC-RPX  [TEMP-PAD]  5.1,49.7 0 top
TP1  DNP-TestPoint  [SMD_ROUND_1MM]  80,48.3 0 top
TP2  DNP-TestPoint  [TH_ROUND_14MM08MM]  72.9,84.7 0 top
TP4  DNP-TestPoint  [TH_ROUND_14MM08MM]  15.7,51.8 180 top
X1  8MHz-5x3.2mm  [7B]  48.9,30 270 top

## Tracks (layer width: path | path; a pad name or v marks a point on that pad's centre or on a via)
1.5V-CAM  (via drill 0.3 pad 0.8)
  Top 0.4: v19.9,65 19.6,65 16.4,68.2 16.4,70.3 15.5,71.2 R126.1 14.4,71.4 L5.1 | L6.2 74.6,76.4 74.6,75.7 71.6,72.7 71.6,67.4 70.9,66.7 68.7,66.7 68,66 v68,65.4
  Bottom 0.4: v68,65.4 67.8,65.6 64.3,65.6 63.7,65 v19.9,65
1.5V-CAM-OUT
  Top 0.4: IC5.5 15.7,75 C19.1 16.9,73 | C20.+ 16.9,72.1 16.9,72.9 16.9,73 | R126.2 16.9,73
3.3V/CAM  (via drill 0.3 pad 0.8)
  Top 0.2: IC5.3 16.9,77.35 | 12.5,70.6 12.8,70.6 13.3,70.1 R11.2 R12.2 | R14.2 R13.2 77.9,51.5 L4.2
  Top 0.3: L1.1 13.9,74 12.5,72.6 12.5,70.6 11.8,69.9 L3.1 | L2.2 77.4,74.9 76.6,75.7 76.6,77.7 77.1,78.2 79.2,78.2 79.8,77.6 79.8,54.1 78.1,52.4 77.8,52.4 L4.2
  Top 0.4: v27.4,65.9 27.4,66.6 23.7,70.3 23.7,71.8 22.3,73.2 C17.+ 22.1,74.5 21.7,74.5 20.9,75.3 C18.1 19.5,75.3 19.35,75.45 IC5.1 17.45,75.45 16.5,76.4 | 16.5,76.4 14,76.4 C16.+ L1.1 | Q1.6 16.25,79.05 Q1.P1 16.4,78.4 16.9,77.9 16.9,77.35 16.9,76.8 16.5,76.4 | v69.1,65.8 71.4,65.8 72.2,66.6 72.2,72.4 73.3,73.5 R16.2 | 73.8,73.7 R16.2 | R16.2 R15.2 75.7,73.5 77,74.8 L2.2
  Bottom 0.4: v69.1,65.8 68.7,66.2 64,66.2 63.4,65.6 27.7,65.6 v27.4,65.9
+3,3V-FILT
  Top 0.4: R28.1 75.7,85.6 C35.1 77.5,85.4 IC6.5
+3.3V  (via drill 0.3 pad 0.7, 0.3 pad 0.8)
  Top 0.2: R104.2 16.3,7.4 | C68.1 17.3,6.4 | R105.2 19,16.9 | 13.3,7.4 R91.2 | R129.1 69.3,83.4 69.6,83.4 73.9,87.7 R28.2 | R66.2 v62.2,70.3 | v35.1,68.5 34.7,68.5 33.9,69.3 R81.2 R89.2 | R103.2 65.2,80.7 v65.2,79.9
  Top 0.28: C47.1 44.8,24.8 IC1.62 39.6,24.8 | 24.1,31 24.1,30.8 IC1.2 26.7,30.8 | 24.2,24 24.2,23.8 IC1.16 27,23.8 | 32.5,16.3 32.7,16.3 IC1.37 32.7,19.1 | 32.5,14.3 32.5,13.9 C49.1 | 37,16.3 37.2,16.3 IC1.46 37.2,19.1 | IC1.55 39.6,21.3 | C52.1 33.5,36.6 34.2,35.9 IC1.86 34.2,31.7
  Top 0.3: C69.1 17,17.9 | R74.2 v62.2,70.3
  Top 0.4: R82.1 C70.1 11.2,80.4 11.2,80.9 11.7,81.4 R106.2 11.7,81.8 12.7,82.8 20.6,82.8 21.6,81.8 R9.2 C21.1 21.6,78.8 21.9,78.5 R8.2 21.9,78.3 C15.1 22.2,76.7 23.7,75.2 23.7,72.7 24.3,72.1 24.3,70.6 v28.5,66.4 | R87.1 C68.1 | 16.3,7.4 17.3,6.4 | v16.2,17.9 C69.1 17.8,17.9 R105.2 | 14.65,8.75 16,7.4 R104.2 | v13.3,5.1 13.3,7.4 14.65,8.75 | 14.65,8.75 14.65,11.59 C81.+ | v22.7,5.6 24.2,4.1 32.1,4.1 33.4,5.4 L13.1
  Top 0.68: C51.1 21.4,33.7 24.1,31 | C50.1 24.2,24 | 32.5,16.3 32.5,14.3 | 37,16.3 37,14 37.2,13.8 C48.1
  Top 0.8: v63,66.4 v63.4,66.8 65.6,69 v65.6,70.3 65.6,77.5 v66.6,78.5 69.2,81.1 R129.1 | R28.2 75.6,87.7 | C81.+ 13.1,12.4 13.1,17.4 13.6,17.9 R65.1 v16.2,17.9 v16.2,17.3 | v28.5,66.4 v29.1,66.4 31.4,64.1 31.4,55.2 29.3,53.1 29.3,52.3 v22.6,45.6 v22.6,45 | 27.2,31.3 26.3,32.2 26.3,33.9 26.5,34.1 v26.5,40.6 v26.5,41.1 | 26.7,30.8 27.2,31.3 | 27.2,31.3 28,30.5 | 28,30.5 28,23.8 | 28,23.8 28,20.1 | 28,20.1 25.5,17.6 24.1,17.6 v22.8,16.3 | 28,30.5 33,30.5 34.2,31.7 | 28,20.1 32.9,20.1 | 32.9,20.1 37.2,20.1 | 37.2,20.1 38.4,21.3 | 38.4,21.3 38.4,23.6 39.6,24.8 | 38.4,21.3 39.6,21.3 | 37.2,20.1 37.2,19.1 | 32.7,19.1 32.7,19.9 32.9,20.1 | 27,23.8 28,23.8 | R87.1 19.3,5.6 v19.1,5.6 v19.7,5.6
  Bottom 0.2: v62.2,70.3 v65.6,70.3 | v35.1,68.5 35.1,66.4 | v65.2,79.9 v66.6,78.5
  Bottom 0.4: J17.2 13.3,3.04 v13.3,5.1 | v19.7,5.6 v22.7,5.6
  Bottom 0.8: v28.5,66.4 v29.1,66.4 35.1,66.4 53.4,66.4 | 53.4,66.4 53.4,68.25 J14.2 | 53.4,66.4 v63,66.4 v63.4,66.8 | v26.5,40.6 v26.5,41.1 v22.6,45 v22.6,45.6 | v22.8,16.3 v22.4,15.9 18.1,15.9 16.7,17.3 v16.2,17.3 v16.2,17.9
+3.3V/1  (via drill 0.3 pad 0.7, 0.3 pad 0.8)
  Top 0.2: R26.1 77.4,43.9 | R27.1 77.4,43.9 | 77.4,43.9 76.5,43 76.5,41.7 78.75,39.45 IC7.8 | R4.2 62.7,21.9 62.7,21.6 C87.+ | IC11.2 82.45,45.35 | 82.45,45.35 81.8,44.7 | R18.1 82.45,47.55 82.45,45.35 | R3.2 80.75,38.55 80.75,38.65
  Top 0.28: 78.8,31.1 IC2.37 v78.8,33.6
  Top 0.35: IC4.20 70.4,25.15 | 70.4,31.95 70.4,32 70.65,32.25 IC3.20
  Top 0.4: 70.4,31.95 70.4,29.2 | v70.2,29.2 70.4,29.2 | 70.4,29.2 70.4,25.15 70.4,20.7 v68.4,18.7 C2.1 | v76,30.4 78.1,30.4 78.8,31.1 | v63.2,20.1 C87.+ 63.6,21.1 | v21.9,7.8 21.9,5.2 23.6,3.5 38.4,3.5 47.7,12.8 51.5,12.8 55.7,17 58.7,17 v58.9,16.8 | Q2.P2 18.15,12.2 Q2.3 18.15,10.8 v19,10.8 | C1.1 v79.7,37.6 80.75,38.65 81,38.9 | IC11.8 81.8,44.7 C28.1 81.8,39.7 81,38.9 | IC7.8 80.45,39.45 81,38.9
  Bottom 0.4: v70.2,29.2 74.8,29.2 v76,30.4 | v68.4,18.7 67,20.1 v63.2,20.1 60.1,17 59.1,17 v58.9,16.8 | v19,10.8 20.9,10.8 21.9,9.8 v21.9,7.8 | v78.8,33.6 78.8,36.7 v79.7,37.6
+3.3V/2  (via drill 0.3 pad 0.8)
  Top 0.2: C41.1 R72.1 R73.2 | R30.2 R34.1 14.2,92.5 14.71,92 IC12.8
  Top 0.3: 16.55,80.35 Q1.P2
  Top 0.4: Q1.3 16.55,80.35 | Q1.P2 16.4,80.8 16.1,81.1 15.7,81.1 v15.3,81.5 v14.9,81.9 | v15.6,87.9 15.6,88.1 v15.9,88.4 C86.+ 17.1,88.6 C41.1 17.1,91.3 16.41,92 IC12.8
  Bottom 0.4: v14.9,81.9 15.6,82.6 v15.6,87.9
+3.3V/VPS  (via drill 0.3 pad 0.7, 0.3 pad 0.8)
  Top 0.2: 8.2,45.44 IC9.7 8.16,46.03 7.9,46.3 6.9,46.3 | 16.85,12.35 Q2.P1
  Top 0.4: 16.85,12.35 Q2.6 16.85,13.6 v16.1,13.6 | v10.6,16.1 9.9,16.1 | 9.9,16.1 9.9,35.8 8.5,37.2 R25.2 8.5,38.4 9.44,39.34 IC9.3 9.44,40.77 v6.9,43.3 IC9.8 6.9,46.3 6.9,46.4 | J15.1 9.9,16.1 | 6.9,46.4 6.9,47.1 C27.1 | C82.1 6,46.4 6.9,46.4
  Bottom 0.4: v16.1,13.6 15.6,14.1 12.6,14.1 v10.6,16.1 | J11.4 v6.9,43.3
/3.3V1PWRON  (via drill 0.3 pad 0.7)
  Top 0.2: v14.2,16.9 14.2,15.7 15,14.9 R24.2 | IC1.21 24.6,21.3 24.4,21.5 O44.P$1 T32.P$1 17.3,21.5 v16.9,21.9
  Bottom 0.2: v14.2,16.9 14.2,19.2 v16.9,21.9
/3.3V2PWRON  (via drill 0.3 pad 0.7, 0.3 pad 0.8)
  Top 0.2: R75.2 13.8,78.2 v14.6,78.2 | v17.6,83.6 21,83.6 24.2,80.4 24.2,73 32.5,64.7 32.5,47.9 31.6,47 31.6,44.6 29.8,42.8 29.8,42 28.8,41 T33.P$1 O23.P$1 28.8,34.4 29.2,34 IC1.96
  Bottom 0.2: v14.6,78.2 17.2,80.8 17.2,83.2 v17.6,83.6
/CAM-PWRON  (via drill 0.3 pad 0.7, 0.3 pad 0.8)
  Top 0.2: R10.1 16.4,81.8 v16.3,81.9 | v16.5,83.6 17.2,84.3 20.9,84.3 24.6,80.6 24.6,73.2 32.9,64.9 32.9,47.7 32,46.8 32,44.4 30.2,42.6 30.2,41.8 29.2,40.8 T30.P$1 O24.P$1 29.2,34.6 29.7,34.1 IC1.95
  Bottom 0.2: v16.3,81.9 16.7,82.3 16.7,83.4 v16.5,83.6
/FMEM1-CS  (via drill 0.3 pad 0.7)
  Top 0.2: v9,30.9 9,35.5 6.9,37.6 R25.1 IC9.1 | IC1.11 O6.P$1 T27.P$1 22.9,26.3 20.3,28.9 19.3,28.9 18.8,29.4 v18.8,30.2
  Bottom 0.2: v9,30.9 18.1,30.9 v18.8,30.2
/MCLR  (via drill 0.3 pad 0.7)
  Top 0.2: IC1.13 22.3,25.3 v22,25.6 | 12.12,4.4 19.9,4.4 20.4,4.9 20.4,18.2 v20.2,18.4 | 12.12,4.4 J17.1 | 12.12,4.4 12.12,5.88 R90.2
  Bottom 0.2: v20.2,18.4 20.2,23.8 v22,25.6
/NCS  (via drill 0.3 pad 0.7)
  Top 0.2: IC1.23 24.4,20.3 24,20.7 O14.P$1 T26.P$1 16.5,20.7 15.7,21.5 15.7,29.4 v16.4,30.1
  Bottom 0.2: 14.7,30.1 v16.4,30.1 8.6,30.1 7.35,31.35 J15.13
/PRESENT  (via drill 0.3 pad 0.8)
  Top 0.2: v4.4,49.4 4.7,49.7 T46.P$1 9.6,49.7 15.7,43.6 R131.2
  Bottom 0.2: J11.G2 v4.4,49.4
/VPS-PWRON  (via drill 0.3 pad 0.7)
  Top 0.2: R107.2 19.3,9.5 20,10.2 20,17.6 v19.2,18.4 | v19,23.4 19.3,23.1 22.5,23.1 22.7,23.3 T31.P$1 O9.P$1 IC1.17
  Bottom 0.2: v19,23.4 19.2,23.2 v19.2,18.4
A0
  Top 0.2: IC3.12 72.7,27.05 82.8,16.95 IC2.20
A1
  Top 0.2: IC3.13 72.7,27.7 83.3,17.1 IC2.21
A2
  Top 0.2: IC3.14 72.7,28.35 83.8,17.25 IC2.22
A3
  Top 0.2: IC3.15 72.7,29 84.3,17.4 IC2.23
A4
  Top 0.2: IC3.16 72.7,29.65 84.8,17.55 IC2.24
A5
  Top 0.2: IC3.17 72.7,30.3 73.3,29.7 83.5,29.7 84.8,31 IC2.25
A6
  Top 0.2: IC2.45 74.8,31.4 75,31.2 75,30.5 74.65,30.15 73.5,30.15 72.7,30.95 IC3.18
A7
  Top 0.2: IC3.19 73.3,31.6 IC2.48
A8
  Top 0.2: IC2.19 82.3,14.9 72.7,24.5 IC4.19
A9
  Top 0.2: IC4.18 72.7,23.85 81.8,14.75 IC2.18
A10
  Top 0.2: IC4.17 72.7,23.2 81.3,14.6 IC2.17
A11
  Top 0.2: IC4.16 72.7,22.55 80.8,14.45 IC2.16
A12
  Top 0.2: IC4.15 72.7,21.9 77.3,17.3 IC2.9
A13
  Top 0.2: IC4.14 72.7,21.25 76.8,17.15 IC2.8
A14
  Top 0.2: IC4.13 72.7,20.6 76.3,17 IC2.7
A15
  Top 0.2: IC4.12 72.65,19.95 75.8,16.8 IC2.6
A16
  Top 0.2: IC1.32 30.2,16.6 30.5,16.3 30.5,10.8 31.7,9.6 32.7,9.6 33.3,9 42.5,9 47.2,13.7 51,13.7 55.2,17.9 59.4,17.9 67.4,9.9 73.9,9.9 75.3,11.3 IC2.5
A17
  Top 0.2: IC1.33 30.7,16.7 30.9,16.5 30.9,11 31.9,10 32.9,10 33.5,9.4 42.3,9.4 47,14.1 50.8,14.1 55,18.3 59.6,18.3 67.6,10.3 73.6,10.3 74.8,11.5 IC2.4
A18
  Top 0.2: IC1.34 31.2,16.8 31.3,16.7 31.3,11.2 32.1,10.4 33.1,10.4 33.7,9.8 42.1,9.8 46.8,14.5 50.6,14.5 54.8,18.7 59.8,18.7 67.8,10.7 73.3,10.7 74.3,11.7 IC2.3
A19
  Top 0.2: IC1.35 31.7,11.4 32.3,10.8 33.3,10.8 33.9,10.2 41.9,10.2 46.6,14.9 50.4,14.9 54.6,19.1 60,19.1 68,11.1 73,11.1 73.8,11.9 IC2.2
A20
  Top 0.2: IC1.41 34.7,12.8 36.1,11.4 41.3,11.4 46,16.1 49.8,16.1 54.6,20.9 58.8,20.9 68.2,11.5 72.7,11.5 73.3,12.1 IC2.1
A+  (1 unrouted)
  Top 0.4: L8.2 36.1,103.5 37.3,104.7 37.3,107.1 39.3,109.1 43.2,109.1 43.77,108.53 J4.4
  Top 0.5: 43.77,91.1 43.77,89.17
  Top 1: J4.4 43.77,102.27 43.2,101.7 43.2,93.3 43.77,92.73 43.77,91.1 | 43.77,89.17 J3.4
A++  (1 unrouted)
  Top 0.2: R34.2 14.2,94.1 14.6,94.5 | 14.6,94.5 15.92,94.5 IC12.6 | 13.35,97.65 14.6,96.4 14.6,94.5
  Top 0.4: 13.35,99.15 R32.2 14,102.8 14.3,103.1 25,103.1 25.5,103.6 32.7,103.6 L8.1
AGND1
  Top 0.3: J1.2 14.2,55.7 C3.1 R6.1 13.3,53.6 11.9,52.2 11.9,52 C9.-
AGND2
  Top 0.3: J2.2 74.7,66.2 C4.1 R7.1 76.6,69.5 77,69.5 C10.-
AVDD
  Top 0.28: IC1.30 29.2,16.3 29.4,16.3
  Top 0.4: C55.1 29.2,13.9 30,13.1 30,9.3 | 30,9.3 30.7,8.6 C56.+ 31.2,8.6 32.4,7.4 35.2,7.4 R92.2 | C88.1 29.3,8.6 30,9.3
  Top 0.6: 29.4,14.4 29.4,14.3 C55.1
  Top 0.68: 29.4,16.3 29.4,14.4
AVDD1
  Top 0.3: J1.4 13.6,56.7 C3.2 12.5,55.6 11.9,55.6 C9.+ 11.2,55.5 10.8,55.5 9.1,57.2 9.1,72.3 10.3,73.5 10.3,73.8 L1.2
AVDD2
  Top 0.3: J2.4 75.3,65.2 C4.2 75.8,65.4 76.8,66.4 77.1,66.4 C10.+ 77.8,67.1 78.1,67.1 78.8,67.8 78.8,70.7 77.9,71.6 L2.1
B-  (1 unrouted)
  Top 0.4: J3.5 45,90.11 | L7.2 36.1,106.1 36.5,106.5 36.5,107.3 39,109.8 43.6,109.8 45.03,108.36 J4.5
  Top 0.5: 45.03,106.1 45.03,104.1
  Top 1: J4.5 45.03,106.1 | 45.03,104.1 45.03,101.83 44.4,101.2 44.4,93.8 45.03,93.17 J3.5
B--  (1 unrouted)
  Top 0.2: 13.35,95.65 13.2,95.5 13.2,93.5 13.4,93.3 15.92,93.3 IC12.7 | R31.1 R32.1
  Top 0.4: 13.35,96.65 12.4,97.6 R32.1 12.4,102.7 13.4,103.7 24.7,103.7 25.2,104.2 31.5,104.2 32.5,105.2 32.5,105.3 L7.1
BT-RTS
  Top 0.2: IC1.83 O32.P$1 T44.P$1 47.3,45.9 47.3,48.6 41.3,54.6 41.3,67.65 J14.7
BT-RX
  Top 0.2: J14.3 50.81,66.89 53.3,64.4 53.3,45.1 42.5,34.3 T40.P$1 O37.P$1 42.5,31 41.8,30.3 IC1.73
BT-TX
  Top 0.2: J14.4 48.27,68.23 52.9,63.6 52.9,45.3 42.1,34.5 T41.P$1 O36.P$1 42.1,31.2 41.7,30.8 IC1.74
CON-LED
  Top 0.2: IC1.78 38.2,33.8 O33.P$1 T43.P$1 50.7,46.3 50.7,50.8 49.6,51.9 46,51.9 42.6,55.3 42.6,67.71 J14.6
CS-SRAM  (via drill 0.3 pad 0.7)
  Top 0.2: IC1.38 O17.P$1 T28.P$1 33.2,15.3 33.5,15 33.5,12.2 34.2,11.5 v34.2,11 | IC2.12 R5.2 75.1,9.7 74.5,9.1 67,9.1 61.8,14.3 60.7,14.3 60.2,14.8 60.2,16.5 59.2,17.5 55.4,17.5 51.2,13.3 47.4,13.3 42.7,8.6 34.5,8.6 v34.2,8.3
  Bottom 0.2: v34.2,11 v34.2,8.3
CURR-SENSE  (via drill 0.3 pad 0.7)
  Top 0.2: R102.2 v28.7,75.1 | v27.6,68.5 28.1,68.5 32.1,64.5 32.1,54.9 31.1,53.9 31.1,49.7 29.1,47.7 26.3,47.7 24.8,46.2 24.8,45.2 17.7,38.1 17.7,29.3 19,28 19.6,28 20,27.6 20,26.3 C66.1 20.8,25.4 21.3,24.9 T39.P$1 O8.P$1 24.65,24.9 24.7,24.9 24.8,24.8 IC1.14
  Bottom 0.2: v28.7,75.1 28.7,69.6 v27.6,68.5
D0  (via drill 0.3 pad 0.7)
  Top 0.2: IC2.29 82.8,33 79.6,36.2 70.6,36.2 70.3,35.9 62.5,35.9 61.9,35.3 60.8,35.3 59.5,34 59.5,30.6 v59.8,30.3 63.05,27.05 IC3.9 66.75,27.05 67.1,26.7 67.1,24.9 66.7,24.5 IC4.2 | IC1.93 30.7,34.3 30,35 30,40.4 31.3,41.7 v31.3,42.1
  Bottom 0.2: v59.8,30.3 59.5,30.6 59.5,31.7 58.8,32.4 53.2,32.4 42.7,42.9 42.7,45.7 40.3,48.1 36.6,48.1 32.6,44.1 32.6,43 31.7,42.1 v31.3,42.1
D1  (via drill 0.3 pad 0.7)
  Top 0.2: IC2.31 81.8,33 79,35.8 70.8,35.8 70.5,35.5 62.7,35.5 62.1,34.9 61,34.9 59.9,33.8 59.9,31.9 60.2,31.6 v60.2,31.3 60.5,31 60.5,30.2 63,27.7 IC3.8 66.7,27.7 67.5,26.9 67.5,24.65 66.7,23.85 IC4.3 | IC1.94 30.2,34.2 29.6,34.8 29.6,40.6 30.6,41.6 30.6,42.4 31.3,43.1 v31.7,43.1
  Bottom 0.2: v60.2,31.3 60.2,31.6 59,32.8 53.4,32.8 43.1,43.1 43.1,45.9 40.5,48.5 36.4,48.5 31.7,43.8 v31.7,43.1
D2  (via drill 0.3 pad 0.7)
  Top 0.2: IC2.33 80.8,33.2 78.6,35.4 71,35.4 70.7,35.1 62.9,35.1 62.3,34.5 61.2,34.5 60.3,33.6 60.3,32.6 v60.6,32.3 60.9,32 60.9,30.45 63,28.35 IC3.7 66.7,28.35 67.9,27.15 67.9,24.4 66.7,23.2 IC4.4 | IC1.98 28.2,33.8 28,34 28,42.4 29.4,43.8 v29.8,43.8
  Bottom 0.2: v60.6,32.3 59.7,33.2 53.6,33.2 43.5,43.3 43.5,46.1 40.7,48.9 36.2,48.9 31.1,43.8 v29.8,43.8
D3  (via drill 0.3 pad 0.7)
  Top 0.2: IC2.35 79.8,33.6 78.4,35 71.2,35 70.9,34.7 63.1,34.7 62.5,34.1 61.8,34.1 v61,33.3 61.3,33 61.3,30.7 63,29 IC3.6 66.7,29 68.3,27.4 68.3,24.15 66.7,22.55 IC4.5 | IC1.99 27.7,33.7 27.6,33.8 27.6,42.6 29.6,44.6 v30.6,44.6
  Bottom 0.2: v61,33.3 60.7,33.6 53.8,33.6 43.9,43.5 43.9,46.3 40.9,49.3 36,49.3 31.3,44.6 v30.6,44.6
D4  (via drill 0.3 pad 0.7)
  Top 0.2: IC2.38 78.3,33 76.7,34.6 71.4,34.6 71.1,34.3 63.3,34.3 62.7,33.7 62.1,33.7 61.7,33.3 61.7,31.6 v62,31.3 62,30.65 63,29.65 IC3.5 66.75,29.65 68.7,27.7 68.7,23.9 66.7,21.9 IC4.6 | IC1.100 27.2,42.8 30,45.6 v30.9,45.6
  Bottom 0.2: v62,31.3 61.7,31.6 61.7,33.6 61.3,34 54,34 44.3,43.7 44.3,46.5 41.1,49.7 35.8,49.7 31.7,45.6 v30.9,45.6
D5  (via drill 0.3 pad 0.7)
  Top 0.2: IC2.40 77.3,33.2 76.3,34.2 71.6,34.2 71.3,33.9 63.5,33.9 62.9,33.3 62.7,33.3 v62.4,33 62.4,31.9 64,30.3 IC3.4 66.7,30.3 69.1,27.9 69.1,23.65 66.7,21.25 IC4.7 | IC1.3 23.7,30.3 20.5,33.5 20.5,36.7 30.4,46.6 v30.9,46.6
  Bottom 0.2: v30.9,46.6 32.1,46.6 35.6,50.1 41.3,50.1 44.7,46.7 44.7,43.9 54.2,34.4 61.5,34.4 62.4,33.5 v62.4,33
D6  (via drill 0.3 pad 0.7)
  Top 0.2: IC2.42 76.3,33.2 75.7,33.8 71.8,33.8 71.5,33.5 63.9,33.5 63.1,32.7 v63.1,32.2 63.1,32.05 64.2,30.95 IC3.3 66.65,30.95 69.5,28.1 69.5,23.4 66.7,20.6 IC4.8 | IC1.4 23.6,29.8 20.1,33.3 20.1,36.9 30.8,47.6 v31.2,47.6
  Bottom 0.2: v31.2,47.6 32.5,47.6 35.4,50.5 41.5,50.5 45.1,46.9 45.1,44.1 54.4,34.8 61.7,34.8 63.1,33.4 v63.1,32.2
D7  (via drill 0.3 pad 0.7)
  Top 0.2: IC2.44 75.3,33.2 75.1,33.4 72,33.4 71.7,33.1 65,33.1 v64.1,32.2 64.7,31.6 IC3.2 66.7,31.6 69.9,28.4 69.9,23.15 66.7,19.95 IC4.9 | v31.8,48.5 31.1,48.5 19.7,37.1 19.7,33.1 23.5,29.3 IC1.5
  Bottom 0.2: v31.8,48.5 32.8,48.5 35.2,50.9 41.7,50.9 45.5,47.1 45.5,44.3 54.6,35.2 61.9,35.2 63.8,33.3 63.8,32.5 v64.1,32.2
D+  (via drill 0.3 pad 0.7, 0.3 pad 0.8)
  Top 0.28: IC1.57 45.8,22.3 v46.1,22
  Top 0.4: v49.9,10.7 49.9,10.4 54.6,5.7 60,5.7 60.75,4.95 IC15.3 62.25,4.95 64.5,7.2 66.2,7.2 68.9,4.5 J12.3_D+
  Bottom 0.4: v46.1,22 49.4,18.7 49.4,11.2 v49.9,10.7
D-  (via drill 0.3 pad 0.7, 0.3 pad 0.8)
  Top 0.28: IC1.56 44.9,21.8 v45.2,21.5
  Top 0.4: v48.8,10.6 54.3,5.1 58.5,5.1 58.65,4.95 IC15.2 59.85,4.95 60.7,4.1 62.3,4.1 62.8,4.6 v63.1,4.6
  Bottom 0.4: v45.2,21.5 45.6,21.1 46.1,21.1 48.8,18.4 v48.8,10.6 | J12.2_D- 69.35,7.2 64.5,7.2 63.1,5.8 v63.1,4.6
DGND  (via drill 0.3 pad 0.7, 0.3 pad 0.8, 0.3 pad 0.9)  (52 unrouted)
  Top 0.2: IC2.47 v73.8,30.9 v74.3,30.9 IC2.46 | Q10.4 20.85,107.75 20.9,107.7 v20.9,105.7 | v20.9,105.7 21.5,105.1 R80.2 C37.2 23.9,105.1 v24.4,105.6 | v20.9,105.7 20.3,105.1 R83.2 | C32.2 v58.4,104.2 v57.8,104.2 | Q13.4 63.45,102.7 63.5,102.7 63.6,102.8 R76.2 v65.1,103.6 v65.1,104.2 | R70.2 v60.6,97.4 v60.6,96.8 | C46.2 v62.7,114.5 v62.1,114.5 | v66.2,115.7 R52.2 R51.1 R53.2 70.85,115.7 | R64.2 72.35,115.7 | 72.35,115.7 R54.2 70.85,115.7 | R96.2 C62.2 60.2,87.9 v60.4,87.7 v60.4,87 59.3,87 C63.2 R99.2 | C77.2 25.5,112 25.1,112.4 v25.1,112.8 | C78.2 v25.1,112.8 | R57.1 14.2,107.7 | 14.2,107.7 14.8,107.7 | 14.8,107.7 15.4,107.7 | 15.4,107.7 R58.2 | v12,114.2 R60.2 12.8,115.5 R59.2 v12.2,115.7 | v14.8,108.3 14.8,107.7 | C58.2 C59.2 | R2.1 v71.7,14.5 | v80,11.1 79.8,11.3 IC2.14 79.8,14.2 | v80,11.1 80.3,11.4 IC2.15 80.3,14.2 79.8,14.2 | R5.1 80.4,10.7 v80,11.1 | 67.25,32.25 v67.7,31.8 | C28.2 v84.2,43 85.2,43 | 51.3,73.3 52,74 R40.1 51.9,74 v51.2,74.7 51.1,74.8 R43.1 | R71.2 v22.1,88 | v25,97 R88.2 Q12.4 25.85,99.85 C38.2 27.3,100 27.3,101.4 R86.2 v28.9,102.2 | v68.9,77.5 R118.2 v68.9,75.7 | C18.2 v19.4,73.7 19.3,73.8 C19.2 | v52.1,76.8 R41.2 | v15.5,89.4 C41.2 | C86.- 13.7,88.7 14.7,89.7 v14.7,89.8 | v16,96.6 16,95.85 IC12.5 17.09,95.81 17.1,95.8 v17.2,95.8 | Q3.1 6.2,90.8 | 6.2,90.8 v6.5,90.5 | 6.2,90.8 v6.5,91.1 6.5,91.9 R112.2 | v9.5,100.7 R31.2 8.8,99.1 8.8,97.7 9.7,96.8 | R48.1 51.3,73.3 | R21.2 73.5,102.5 72.8,103.2 69.7,103.2 68.2,101.7 68.2,100.1 68.4,99.9 71.4,99.9 71.4,98.9 | v70.85,116.3 70.85,115.7 | v72.35,116.3 72.35,115.7 | C79.2 v63.1,112 v62.5,112 | C80.2 v63.1,109.1 v62.5,109.1 | C51.2 v22.3,35.6 | IC9.4 10.75,40 v11.5,40 12.2,40 v12.2,39.1 R127.1
  Top 0.2: v14.8,107.1 14.8,107.7 | v14.8,108.3 14.2,107.7 | v14.8,108.3 15.4,107.7 | v25.1,112.8 v25.9,112.8 | R44.2 v51.2,71.8 51.3,71.9 51.3,73.3 | 74.15,70 C75.2 | 75.35,70 R7.2 | Q14.1 68.8,75.6 v68.9,75.7 | v69.5,75.7 v68.9,75.7 | C81.- 8.76,10.94 9.1,10.6 C40.2 3.81,9 PCB1.PAD_GND_3 | 28.1,7.8 28.1,9.3 28.2,9.4 | IC11.4 85.2,46.65 v85.2,46.7 85.2,46 | IC7.7 v81,40.1 | IC11.3 85.2,46 | 85.2,46 v85.2,44.7 | IC7.1 85.2,39.45 v85.2,39.5 85.2,40.1 | IC7.2 85.2,40.1 | IC7.3 85.2,40.75 | 85.2,40.75 85.2,40.1 | IC7.4 v85.2,41.4 | v85.2,41.4 85.2,40.75 | IC11.1 v85.2,44.7 | v85.2,44.7 85.2,43 | 85.2,43 v85.2,41.4 | v80.6,11.1 v80,11.1 | v22.9,12.3 C64.2 | v79.7,14.3 79.8,14.2 | v51,30 51.2,30 | IC2.26 84.3,31.2 84,30.9 83.8,30.9 83.8,31 IC2.27 83.8,33.6 v84.3,33.6 IC2.26 | Q11.4 76.05,116.75 76.1,116.8 v76.2,116.8 v76.8,116.8 R67.2 77.6,116.8 76.7,115.9 Q11.4
  Top 0.28: IC1.45 36.7,18.5 v36.2,19 | v31.7,19 32.2,18.5 IC1.36 | IC1.31 v29.7,19 | IC1.15 26.4,24.3 v26.9,24.8 | IC1.75 39.8,31.3 v39.5,31.6 | C51.2 v21.4,36.4 | 43.1,26.4 43,26.3 IC1.65 v39.5,26.3
  Top 0.3: IC8.10 73.9,96.4 | R19.2 R21.2 | C24.1 70.8,93 72.4,93 R17.2 73.95,94.55 | R6.2 13.6,52 | v14.2,52.6 14.6,53 v14.6,53.2 | C7.1 12.6,57.8 v12.5,57.9 | v12.5,57.9 12.5,57.6 12.1,57.2 11.8,57.2 C13.- | v12.5,57.9 12.5,58.4 v12.3,58.6 | v13.1,63.1 v13.7,63.1 13.4,62.8 C5.2 13.5,62.2 J1.15 v16.8,62.2 | v11.6,64 11.5,64.1 C11.- 11,64.5 v11,64 | v72.2,59.7 J2.15 75.4,59.7 C6.2 75.5,59.1 | 75.5,59.1 v75.8,58.8 v75.2,58.8 75.5,59.1 | C12.- 77.4,57.4 | 77.4,57.4 77.4,57.7 v77.2,57.9 | v77.9,57.9 77.4,57.4 | 75.7,64.1 C8.1 75.6,64 | 76.6,64.2 v76.6,64 76.4,63.8 v76.4,63.4 | v13.4,64.5 C76.2 | v39.6,13.5 C48.2 v38.8,14.4 | v75.3,70.8 75.3,70.2 R7.2
  Top 0.35: 64.65,25.15 IC4.1 v65.9,25.8 IC3.10 | 65.7,19.3 64.9,19.3 64.6,19.6 | IC4.10 65.7,19.3 | 65.7,19.3 v65.7,18.7 | IC3.1 67.25,32.25
  Top 0.4: IC8.EP 73.9,97.5 73.1,98.3 73.1,100.4 R19.2 | v74.6,98.8 74.2,98.8 v73.9,98.8 | 13.6,52 v14.2,52.6 | 75.7,64.1 v76.4,63.4 | v76.6,64 75.6,64 | IC6.2 v78.5,87 v78.5,85.7 78.5,84.8 C35.2 R46.1 | IC16.4 v60.4,87 | v60.1,81 60.2,80.9 C67.2 60.4,81.4 v60.4,81.8 | IC10.2 26,88.5 v26.4,88.9 v26.4,89.5 26.35,89.45 IC10.1 | IC13.3 v25.7,9.4 28.2,9.4 C88.2 v29,11.5 | C59.2 v27.8,5.2 29.2,5.2 29.4,5.4 v29.6,5.4 C56.- | 50.3,34.3 51.2,33.4 51.2,30 51.2,26.9 50.2,25.9 | 43.1,26.4 46.1,29.4 46.1,32.8 46.9,33.6 v47.2,33.6 47.2,33.9 48.2,34.9 49.7,34.9 50.3,34.3 | 50.3,34.3 C61.2 | 50.2,25.9 49.3,25 v47,25 C47.2 v46.2,25.9 | 50.2,25.9 C60.2 | C87.- 63.8,24.3 | 63.8,24.3 64.65,25.15 | 64.6,19.6 64.6,23.5 63.8,24.3 | R1.1 67.6,16.3 | 67.6,16.3 C2.2 | 67.6,16.3 v67.6,15.7 | C16.- v11.7,76.5 | C20.- v19.3,71.9 | IC5.2 v19.1,76.4 | C15.2 19.6,76.7 v19.5,76.8 | v22.2,72.1 22.3,72 C17.- | v79.9,89.4 80.1,89.6 85.1,89.6 85.6,90.1 85.6,101.05 | v5.8,48.4 5.7,48.3 | 5.7,48.3 5.6,48.2 C82.2 4.9,47.6 4.4,47.1 4.4,45.7 5.2,44.9 v5.7,44.9 | 5.7,48.3 7.9,48.3 v7.9,48.1 | D5.K 13.5,47.7 v13.5,49.2 | 74.15,70 v74.75,69.4 75.35,70 | v75.9,70.8 75.9,70.4 R7.2 | C49.2 v32.6,11.5 v33.2,11.5 | C57.2 27.5,11.6 | 27.5,11.6 v27.5,11.5 | C55.2 v29,11.5 | v29,11.5 27.6,11.5 27.5,11.6 | 28.1,7.8 C58.2 v27.8,6.7 | C85.2 v59.5,8.6 | v58.9,7.6 IC15.1 | v65.9,25.8 v64.5,25.8 | C1.2 v76.4,37.6 v76.4,38.3 | v26.3,16.7 26,16.4 24.3,16.4 22.1,14.2 22.1,12.3 v22.9,12.3 | v13.4,51.2 R6.2 | C64.2 v24.6,11.5 v25.3,11.5 C36.2 C64.2
  Top 0.5: 83.5,30.7 v83.4,30.7
  Top 0.6: 83.8,31 83.5,30.7 | v83.4,30.7 v82.8,30.7
  Top 0.8: v39.5,31.6 v36.9,31.6 | v73.2,96 v73.9,96 v74.6,96 | L12.1 47.2,81.5 46.2,81.5 v46.2,81.8 | v46.2,81.8 v46.2,81.2 v46.2,80.6 47.2,80.6 | v46.2,81.8 v46.2,82.4 | C29.2 v35.1,87.5 v35.1,88.1 v35.1,90 v35.1,90.6 35.1,91.8 C83.2 | v35.4,39.1 C54.- | v36.4,38.8 37,39.4 C53.2 36.4,39.4 35.7,40.1 C54.- | v34.4,38.3 C52.2 33.5,38.7 34.9,40.1 C54.- | v39.5,31.6 40.5,32.6 40.5,33.9 v45.5,38.9 v48.7,42.1 v51.4,44.8 52.2,45.6 v52.2,57 v52.2,61.1 | J14.1 55.89,67.19 54.8,66.1 v54.8,61.1 v54.8,57 v54.8,54.6 | C31.- v70.48,90.6 70.1,90.6 69.8,90.9 69.31,90.9 D2.- | v31.7,19 v29.7,19 | v36.2,19 v33.7,19 | v39.5,26.3 v39.5,31.6 | v26.9,24.8 v26.9,26.8 v26.9,29.4 | C50.2 19.9,24 v19.4,24.5 19.2,24.7 C66.2 19.2,26.3 | 19.2,26.3 C65.2 | v18.6,26.25 19.15,26.25 19.2,26.3 | 24.5,50.2 v27.4,53.1 v27.4,57 30.3,59.9 v30.3,61 30.3,62.7 28.4,64.6 25.7,64.6 23.2,67.1 | 24.5,50.2 v19.7,45.4 | 22.8,51.9 24.5,50.2 | v8.6,48.1 10.1,48.1 v12.2,46 | v7.9,48.1 v8.6,48.1 | v8.6,48.1 C27.2 | v62.2,37 69.6,37 v70.3,37.7 | v62.2,37 60,37 58.2,35.2 v58.2,31.7 58.2,29.3 | v58.2,61.1 58.2,63.4 60.4,65.6 60.4,66.8 v61.1,67.5 63.4,69.8 63.4,73.4 | v39.38,67.5 39.38,67.32 39.4,67.3 39.4,66 | 39.4,66 v39.4,61 v39.4,57 v39.4,53.8 | v47,67.5 v47,61 v47,57 v47,54.2 | v36.2,67.6 37.8,66 39.4,66 | v11.9,26.25 v11.9,23.8 v11.9,16.1 11.9,15.54 v10.3,13.94 C81.- v10.6,12.4 | v13,37 v13,26.25 | v59.3,37 v62.2,37 | v43.6,61 v43.6,57 | v80.5,110.3 80.5,112.7 C84.2 81.3,112.7 v81.3,110.3 v80.5,110.3
  Top 0.813: v74.1,90.6 C31.-
  Top 1.2: 73.9,96.4 IC8.EP 73.9,97.9 74,98 arc90 74.1,98.1 74.1,98.5 74.2,98.5 | v73.9,96 73.9,94.6 73.95,94.55 C30.2 74.9,93.24 C31.- | 78.6,101.6 C23.2 C22.2 82.35,101.7 83.7,103.05 D7.A
  Top 1.4: 78.6,101.6 77.4,100.4 75.5,100.4 74.2,99.1 74.2,98.8 74.2,98.5
  Top 1.6: 73.9,96.4 v73.9,96
  Bottom 0.2: v65.7,18.7 65.7,17.6 v67.6,15.7 70.5,15.7 v71.7,14.5 79.4,14.5 80.1,13.8 80.1,11.2 v80,11.1 85.09,11.1 PCB1.PAD_GND_4 | 67.7,30.9 v73.8,30.9 75.1,30.9 75.4,31.2 76.4,31.2 81.2,31.2 81.2,30.7 v82.8,30.7 | v67.7,31.8 67.7,30.9 | 67.7,30.9 67.7,27.6 v65.9,25.8 | 75.5,57.9 75.5,53.6 85.2,53.6 v85.2,46.7 | 60.1,77.4 52.7,77.4 v52.1,76.8 | v51.2,74.7 51.2,74.15 v51.1,74.05 | 22.1,89.4 26.4,89.4 v26.4,88.9 | 22.1,89.4 v15.5,89.4 14.7,89.4 v14.7,89.8 14.7,95.8 | 22.1,89.4 v22.1,88 22.1,87.1 19.5,87.1 v19.5,76.8 | 14.7,95.8 16,95.8 v16,96.6 | v17.2,95.8 25,95.8 v25,97 | v68.9,77.5 60.1,77.5 | 60.1,77.5 v60.1,81 | v11.7,76.5 v11.7,75.9 11.6,75.8 11.6,72.2 | v26.4,89.5 26.4,90.2 34.9,90.2 v35.1,90 | 14.7,95.8 v10.7,95.8 9.8,95.8 | 9.8,95.8 9.8,94.4 v6.5,91.1 | v9.8,96 9.8,95.8 | v76.2,116.8 67.3,116.8 v66.2,115.7 63.9,115.7 v62.7,114.5 62.7,112.2 | 62.7,112.2 62.7,109.1 | 62.7,109.1 62.7,106 | 62.7,106 64.2,104.5 | v62.5,112 62.7,112.2 | v62.5,109.1 62.7,109.1 | v58.4,104.2 60.9,104.2 62.7,106 | v60.6,97.4 67.6,97.4 | v8.6,48.1 v7.9,48.1 | J11.G4 15,50.5 14.2,51.3 v14.2,52.6 | J11.G4 14.4,49.1 | 17.8,49.2 17.7,49.1 | 15.6,49.1 J11.G4 | 9.1,49.1 8.7,49.5 J11.G3 | v12.2,115.7 12,115.7 v12,114.2 12,111.9 | 12,111.9 12,107.1 v14.8,107.1 18.7,107.1 18.7,105.7 v20.9,105.7 | v25.9,112.8 25.9,105.6 | 25.9,105.6 v24.4,105.6 | v28.9,102.2 28.9,104.7 25.9,104.7 25.9,105.6 | PCB1.PAD_GND_1 3.81,111.9 12,111.9 | PCB1.PAD_GND_2 85.09,110.3 v81.3,110.3 | 11.6,72.2 v11.6,64 | v19.3,72.6 19.3,72.2 11.6,72.2 | 30,40.7 32.4,38.3 v34.4,38.3 | PCB3.1 35.4,40.9 v35.4,39.1 | v69.5,75.7 75.9,75.7 v75.9,70.8 | v81,40.1 82.3,41.4 v85.2,41.4 | 60.1,77.5 60.1,77.4
  Bottom 0.2: 60.1,77.4 60.1,76.1 59.3,76.1
  Bottom 0.28: v26.9,24.8 26.4,24.3 | v39.6,13.5 36.7,13.5 36.7,18.5 v36.2,19 | v32.6,11.5 32.2,11.5 32.2,18.5 v31.7,19 | v29,11.5 29.7,11.5 v29.7,19
  Bottom 0.3: v14.2,52.6 13.4,52.6 13.4,57.9 | 13.4,57.9 13.4,63.1 | 13.4,63.1 v13.1,63.1 | v12.5,57.9 13.4,57.9 | v11.6,64 13.4,64 | 13.4,64 13.4,63.1 | v75.8,58.8 75.5,58.8 | 75.5,58.8 75.5,63.4 | 75.5,63.4 75.5,70.8 v75.9,70.8 | 75.5,63.4 v76.4,63.4 | v77.2,57.9 75.5,57.9 75.5,58.8 | 13.4,64 v13.4,64.5
  Bottom 0.4: v60.4,81.8 v60.4,87 | v22.2,72.1 v21.6,72.1 19.3,72.1 | 19.3,72.1 v19.3,72.6 19.3,73.7 | v19.3,71.9 19.3,72.1 | v19.4,73.7 19.3,73.7 | v19.1,76.4 19.3,76.4 | 19.3,76.4 19.3,73.7 | v19.5,76.8 19.3,76.8 19.3,76.4 | v74.1,90.6 76.7,90.6 78.5,88.8 | J11.6 5.7,45.5 v5.7,44.9 | J11.G1 4.45,38.4 v5.4,38.4 | 9.1,48.1 v8.6,48.1 | v13.5,49.2 13.4,49.1 | v25.3,11.5 25.7,11.5 | 25.7,11.5 v27.5,11.5 | 25.7,11.5 v25.7,9.4 25.7,8.8 v27.8,6.7 28.3,6.7 v29.6,5.4 | 58.9,8.6 v59.5,8.6 65.2,8.6 | 58.9,8.6 v58.9,7.6 | 58.9,8.6 PCB2.VPS_PCB_1 | v76.4,38.3 v76.4,37.6 76.4,31.2 | v84.2,43 81.1,43 v76.4,38.3 | v76.4,38.3 70.9,38.3 v70.3,37.7 | 78.5,88.8 v78.5,87 | v79.9,89.4 79.3,88.8 78.5,88.8 | 85.09,3.7 PCB1.PAD_GND_4 | v46.2,25.9 45.8,26.3 v39.5,26.3
  Bottom 0.6: 14.4,49.1 13.4,49.1 9.1,49.1 9.1,48.1 | 17.7,49.1 15.6,49.1
  Bottom 0.8: J17.3 15.8,5.8 10.6,11 v10.6,12.4 | J6.1 35.1,105.8 35.1,100.5 | 35.1,100.5 35.1,96.1 36.6,94.6 36.6,93.4 35.1,91.9 v35.1,90.6 v35.1,90 v35.1,88.1 v35.1,87.5 40.2,82.4 v46.2,82.4 47.3,82.4 52.6,87.7 v60.4,87.7 67.6,94.9 | J5.1 51.5,109.6 51.5,104.1 47.9,100.5 35.1,100.5 | 22.3,57 v27.4,57 v39.4,57 v47,57 v52.2,57 v54.8,57 | v30.3,61 v39.4,61 v47,61 47.2,61 47.6,61.4 50.3,61.4 50.6,61.1 v52.2,61.1 v54.8,61.1 v58.2,61.1 | 35.4,31.6 v36.9,31.6 | 67.6,94.9 70.1,97.4 72.5,97.4 v73.9,98.8 | 67.6,94.9 67.6,97.4 67.6,101.1 v65.1,103.6 64.2,104.5 70,110.3 v80.5,110.3 | 35.4,31.6 35.4,26.8 | 35.4,26.8 35.4,19 v36.2,19 | v33.7,19 v31.7,19 | J15.9 7.29,26.25 v11.9,26.25 v13,26.25 v18.6,26.25 19.45,26.25 20,26.8 v26.9,26.8 35.4,26.8 | 30,40.7 30,42.1 28.6,43.5 28.6,45.4 | v5.4,38.4 5.6,38.4 5.6,37 10.6,37 | 10.6,37 12.2,37 | 12.2,37 v12.2,39.1 v12.2,46 17.15,46 17.23,46.08 | J11.G5 19.05,47.9 17.23,46.08 | 12.2,37 v13,37 18.5,37 J11.G6 21,36 v21.4,36.4 | v19.7,45.4 17.9,45.4 17.23,46.08 | 10.6,37 10.6,33.3 | 35.4,31.6 v35.4,39.1 | v51.2,74.7 56.1,74.7 57.5,76.1 59.3,76.1 59.3,74.1 58.1,72.9 57.1,72.9 55.89,71.69 J14.1
  other vias: 24,35.6 48.2,21.9 41,18 26.9,22 39.5,22.5 30.9,31.6 64,45 57,46 56,50 30,77 53,91.8 37,100 44,116 77,110 39,6.4 15.8,5.2 73.6,17.6 77.8,20.6 69.1,12.3 69.8,72.7 72.6,75.1 44.4,1 44.4,120.9 1,87 87.9,87 1,45 87.9,46 29.2,21.3 25.4,99.2 12.3,112.3 6,95.6 85.3,105.4 78.3,83.7 42.2,51.8 36.2,51.8 46,48 26.2,66 21.4,66 24.4,50.1 52.2,54.6 57.7,87.9 59.4,90.4 68.68,90 51.8,4.7 53,93.6
  pour Top (isolate 0.35): 0.5,0.5 88.5,0.5 88.5,121.5 0.5,121.5
  pour Bottom (isolate 0.35): 0.5,0.5 88.5,0.5 88.5,121.5 0.5,121.5
DGND-F  (2 unrouted)
  Top 0.8: L12.2 50.6,81.3 50.6,81.8 50.7,81.9 50.7,83.7 51.4,84.4
  Top 1: J4.7 47.58,106.38 J4.8 47.58,103.84 47.58,100.97 46.8,100.2 46.8,94.9 47.58,94.12 J3.7 47.58,88.88 J3.8 50.8,85.66 50.8,84.4 51.4,84.4 D4.A | J3.2 41.23,84.97 D3.A
  Bottom 1: J4.2 41.23,104.38 42.2,103.4 47.13,103.4 J4.8 | J3.2 42.94,85.9 47.13,85.9 J3.8
DOOR1IN  (via drill 0.3 pad 0.7, 0.3 pad 0.8)
  Top 0.2: Q13.3 63.5,100.4 63.5,96.8 60.7,94 55.9,94 54.4,92.5 54.4,75 v57.6,71.8 57.9,71.5 57.9,66.9 56.3,65.3 56.3,54.8 59.4,51.7 v59.4,51.3 | IC1.50 39.2,16.8 39.6,16.4 O21.P$1 T12.P$1 41.1,16.4 43.6,18.9 48.4,18.9 54.7,25.2 54.7,37.5 56.9,39.7 68,39.7 71.6,43.3 71.6,50.6 71,51.2 69,51.2 v68.5,51.7 | R74.1 v59.8,71.8
  Bottom 0.2: v68.5,51.7 68.3,51.9 63.5,51.9 62.9,51.3 v59.4,51.3 | v59.8,71.8 v57.6,71.8
DOOR2IN  (via drill 0.3 pad 0.8)